# EAGLE design Pico_40Pin_Keyboard (EAGLE 9.6.2)
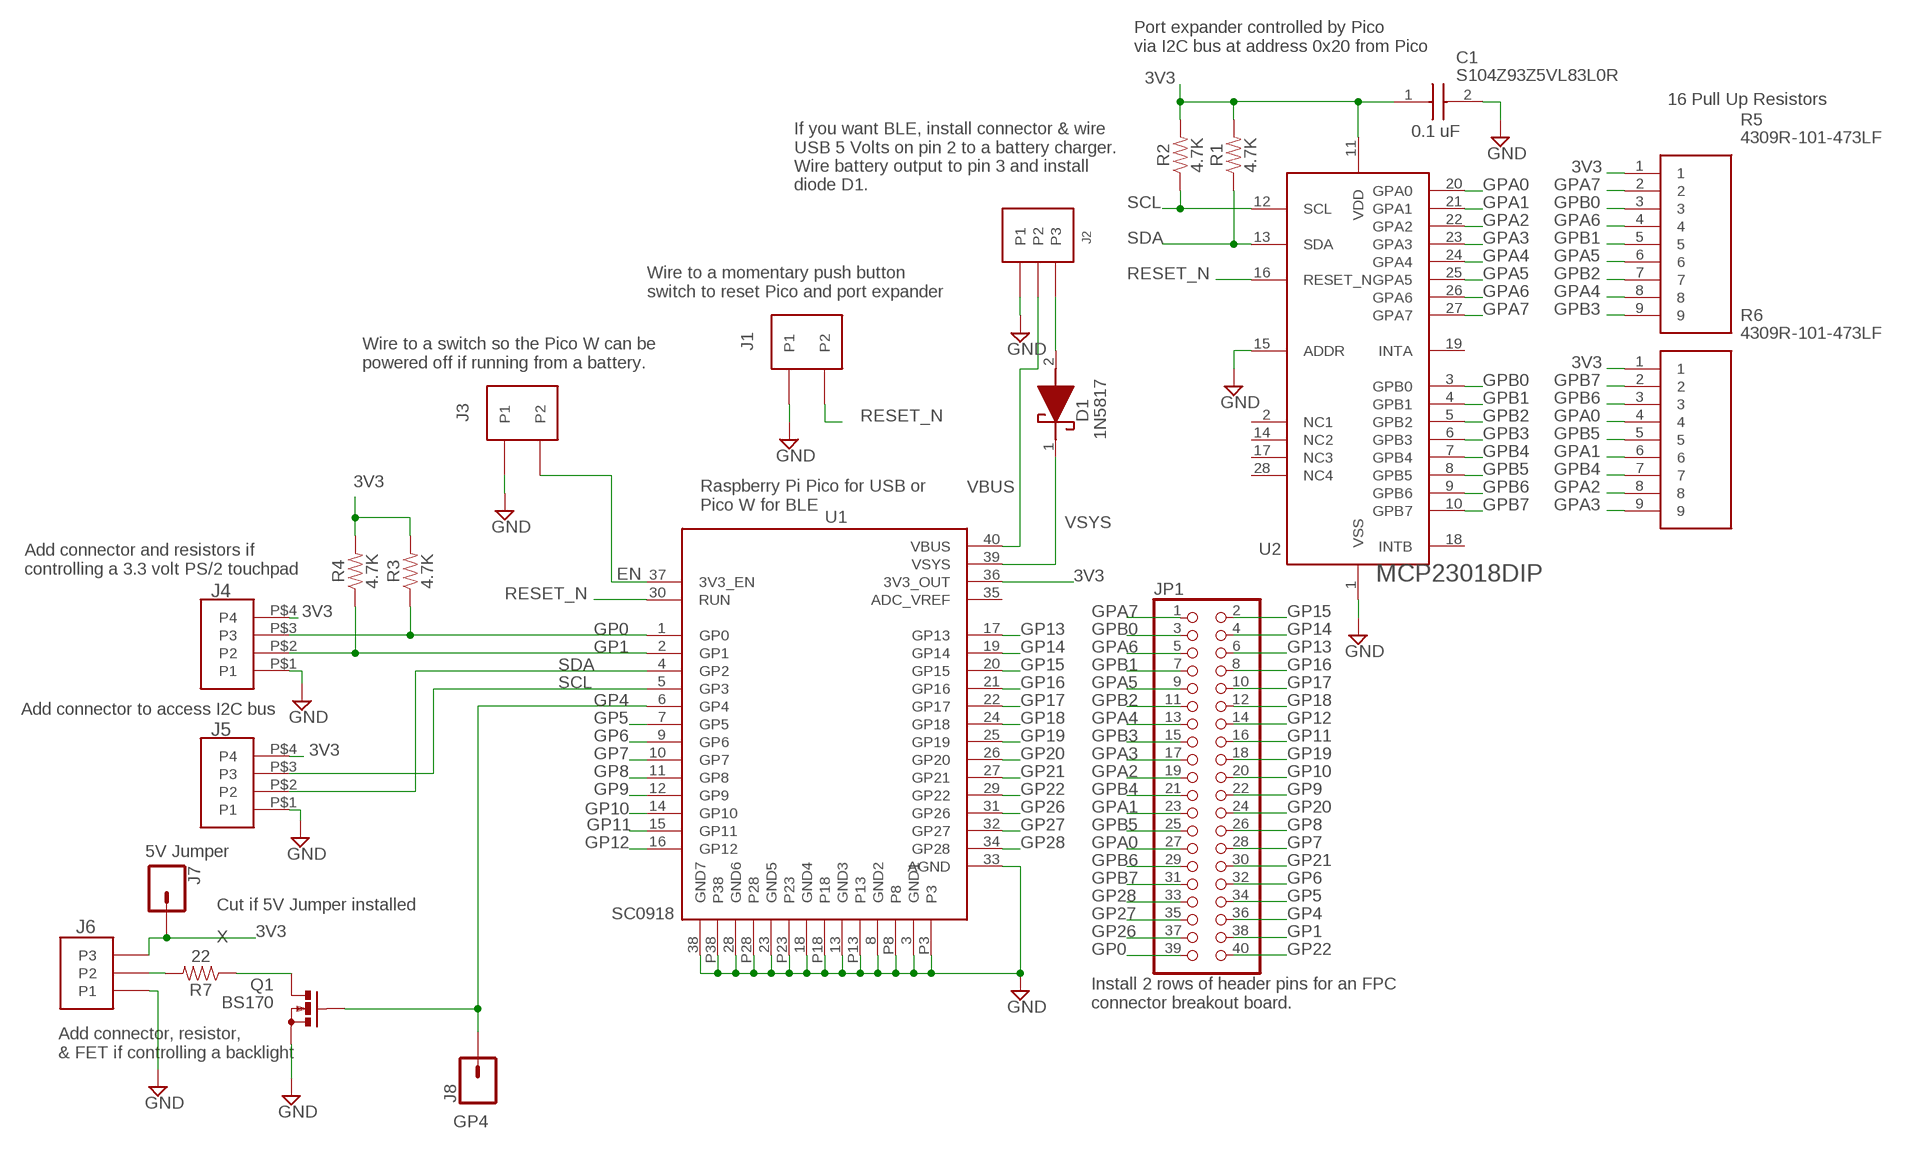
[diagram p0: schematic, sheet 1]

## Parts
C1  S104Z93Z5VL83L0R  [S104Z93Z5VL83L0R]
D1  1N5817  [DIOAD1410W86L470D235]
J1  JST-PH-2PIN  [JST-PH-2PIN]
J2  JST-PH-3PIN  [JST-PH-3PIN]
J3  JST-PH-2PIN  [JST-PH-2PIN]
J4  JST-PH-4PIN  [JST-PH-4PIN]
J5  JST-PH-4PIN  [JST-PH-4PIN]
J6  JST-PH-3PIN  [JST-PH-3PIN]
J7  CONN_01  [1X01]
J8  CONN_01  [1X01]
JP1  PINHD-2X20  [2X20]
Q1  BS170  [SOT54E]
R1  4.7K  RESISTOR_AXIAL  [AXIAL-0.3]
R2  4.7K  RESISTOR_AXIAL  [AXIAL-0.3]
R3  4.7K  RESISTOR_AXIAL  [AXIAL-0.3]
R4  4.7K  RESISTOR_AXIAL  [AXIAL-0.3]
R5  4309R-101-473LF  [4309R-101-473LF]
R6  4309R-101-473LF  [4309R-101-473LF]
R7  22  RESISTOR_AXIAL  [AXIAL-0.3]
U1  SC0918  [MODULE_SC0918]
U2  MCP23018DIP  [MCP23018DIP]

## Nets
3V3: C1.1 J4.P$4(P4) J5.P$4(P4) J6.P$3(P3) J7.1 R1.P$2 R2.P$2 R3.P$2 R4.P$2 R5.1 R6.1 U1.36(3V3_OUT) U2.11(VDD)
EN: J3.P$2(P2) U1.37(3V3_EN)
GND: C1.2 J1.P$1(P1) J2.P$1(P1) J3.P$1(P1) J4.P$1(P1) J5.P$1(P1) J6.P$1(P1) Q1.S U1.3(GND1) U1.8(GND2) U1.13(GND3) U1.18(GND4) U1.23(GND5) U1.28(GND6) U1.33(AGND) U1.38(GND7) U1.P3 U1.P8 U1.P13 U1.P18 U1.P23 U1.P28 U1.P38 U2.1(VSS) U2.15(ADDR)
GP0: J4.P$3(P3) JP1.39 R3.P$1 U1.1(GP0)
GP1: J4.P$2(P2) JP1.38 R4.P$1 U1.2(GP1)
GP4: J8.1 JP1.36 Q1.G U1.6(GP4)
GP5: JP1.34 U1.7(GP5)
GP6: JP1.32 U1.9(GP6)
GP7: JP1.28 U1.10(GP7)
GP8: JP1.26 U1.11(GP8)
GP9: JP1.22 U1.12(GP9)
GP10: JP1.20 U1.14(GP10)
GP11: JP1.16 U1.15(GP11)
GP12: JP1.14 U1.16(GP12)
GP13: JP1.6 U1.17(GP13)
GP14: JP1.4 U1.19(GP14)
GP15: JP1.2 U1.20(GP15)
GP16: JP1.8 U1.21(GP16)
GP17: JP1.10 U1.22(GP17)
GP18: JP1.12 U1.24(GP18)
GP19: JP1.18 U1.25(GP19)
GP20: JP1.24 U1.26(GP20)
GP21: JP1.30 U1.27(GP21)
GP22: JP1.40 U1.29(GP22)
GP26: JP1.37 U1.31(GP26)
GP27: JP1.35 U1.32(GP27)
GP28: JP1.33 U1.34(GP28)
GPA0: JP1.27 R6.4 U2.20(GPA0)
GPA1: JP1.23 R6.6 U2.21(GPA1)
GPA2: JP1.19 R6.8 U2.22(GPA2)
GPA3: JP1.17 R6.9 U2.23(GPA3)
GPA4: JP1.13 R5.8 U2.24(GPA4)
GPA5: JP1.9 R5.6 U2.25(GPA5)
GPA6: JP1.5 R5.4 U2.26(GPA6)
GPA7: JP1.1 R5.2 U2.27(GPA7)
GPB0: JP1.3 R5.3 U2.3(GPB0)
GPB1: JP1.7 R5.5 U2.4(GPB1)
GPB2: JP1.11 R5.7 U2.5(GPB2)
GPB3: JP1.15 R5.9 U2.6(GPB3)
GPB4: JP1.21 R6.7 U2.7(GPB4)
GPB5: JP1.25 R6.5 U2.8(GPB5)
GPB6: JP1.29 R6.3 U2.9(GPB6)
GPB7: JP1.31 R6.2 U2.10(GPB7)
N$1: J6.P$2(P2) R7.P$2
N$2: Q1.D R7.P$1
RESET_N: J1.P$2(P2) U1.30(RUN) U2.16(RESET_N)
SCL: J5.P$3(P3) R2.P$1 U1.5(GP3) U2.12(SCL)
SDA: J5.P$2(P2) R1.P$1 U1.4(GP2) U2.13(SDA)
VBAT: D1.2(A) J2.P$3(P3)
VBUS: J2.P$2(P2) U1.40(VBUS)
VSYS: D1.1(K) U1.39(VSYS)
Unconnected: U2.2(NC1) U2.14(NC2) U2.17(NC3) U2.18(INTB) U2.19(INTA) U2.28(NC4)

## Notes on the sheet
- Port expander controlled by Pico
  via I2C bus at address 0x20 from Pico
- 16 Pull Up Resistors
- 0.1 uF
- If you want BLE, install connector & wire
   USB 5 Volts on pin 2 to a battery charger.
   Wire battery output to pin 3 and install
   diode D1.
- Wire to a momentary push button 
  switch to reset Pico and port expander
- Wire to a switch so the Pico W can be
  powered off if running from a battery.
- Raspberry Pi Pico for USB or 
  Pico W for BLE
- Add connector and resistors if
  controlling a 3.3 volt PS/2 touchpad
- Add connector to access I2C bus
- 5V Jumper
- Cut if 5V Jumper installed
- X
- Install 2 rows of header pins for an FPC
  connector breakout board.
- Add connector, resistor, 
  & FET if controlling a backlight
- GP4

## Power pins joined to a net without a drawn wire
ADC_VREF: U1.35(ADC_VREF)

## Library data of the parts
C1 = SamacSys_Parts:S104Z93Z5VL83L0R: 0.1 F -20%, +80% 500V Ceramic Capacitor Z5V Radial, Disc Source: Datasheet <http://www.vishay.com/docs/28546/s104z93z.pdf>; DESCRIPTION: 0.1 F -20%, +80% 500V Ceramic Capacitor Z5V Radial, Disc; HEIGHT: 26.6mm; MANUFACTURER_NAME: Vishay; MANUFACTURER_PART_NUMBER: S104Z93Z5VL83L0R; MOUSER_PART_NUMBER: 594-S104Z93Z5VL83L0R; MOUSER_PRICE-STOCK: https://www.mouser.co.uk/ProductDetail/Vishay-BC-Components/S104Z93Z5VL83L0R?qs=MZE%2F3ll%252Bp%2Fba6C%252BzoK7Jpg%3D%3D
D1 = SamacSys_Parts:1N5817: Schottky Diodes & Rectifiers 1A, 20V, Schottky Rectifier Source: Datasheet <https://services.taiwansemi.com/storage/resources/datasheet/1N5817 SERIES_H2104.pdf>; DESCRIPTION: Schottky Diodes & Rectifiers 1A, 20V, Schottky Rectifier; HEIGHT: mm; MANUFACTURER_NAME: Taiwan Semiconductor; MANUFACTURER_PART_NUMBER: 1N5817; MOUSER_PART_NUMBER: 821-1N5817; MOUSER_PRICE-STOCK: https://www.mouser.co.uk/ProductDetail/Taiwan-Semiconductor/1N5817?qs=G5AQjGfRJcITga2hz4Rc2w%3D%3D
J1 J3 = JST-PH-2PIN:JST-PH-2PIN
J2 J6 = JST-PH-3PIN:JST-PH-3PIN
J4 J5 = JST-PH-4PIN:JST-PH-4PIN
J7 J8 = SparkFun-Connectors:CONN_01: Single connection point. Often used as Generic Header-pin footprint for 0.1 inch spaced/style header connections On any of the 0.1 inch spaced packages, you can populate with these: Break Away Headers - Straight <https://www.sparkfun.com/products/116> (PRT-00116) Break Away Male Headers - Right Angle <https://www.sparkfun.com/products/553> (PRT-00553) Female Headers <https://www.sparkfun.com/products/115> (PRT-00115) Break Away Headers - Machine Pin <https://www.sparkfun.com/products/117> (PRT-00117) Break Away Female Headers - Swiss Machine Pin <https://www.sparkfun.com/products/743> (PRT-00743) This device is also useful as a general connection point to wire up your design to another part of your project. Our various solder wires solder well into these plated through hole pads. Hook-Up Wire - Assortment (Stranded, 22 AWG) <https://www.sparkfun.com/products/11375> (PRT-11375) Hook-Up Wire - Assortment (Solid Core, 22 AWG) <https://www.sparkfun.com/products/11367> (PRT-11367) View the entire wire category on our website here <https://www.sparkfun.com/categories/141> Special notes: SMTSO-256-ET is a "flush mount" nut for a 4-40 screw. We mostly use this on specialty testbeds; it is a nice way to connect hardware to your PCB at an adjustable hieght. Also note, the SNAP packages are for using a snappable style connector. We sell a baggie of snaps and they are also used on two LilyPad designs: Snap Assortment - 30 pack (male and female) <https://www.sparkfun.com/products/11347> (DEV-11347) LilyPad Arduino SimpleSnap <https://www.sparkfun.com/products/10941> (DEV-10941) LilyPad SimpleSnap Protoboard <https://www.sparkfun.com/products/10940> (DEV-10940)
JP1 = pinhead:PINHD-2X20: PIN HEADER
Q1 = transistor-small-signal:BS170: N-CHANNEL MOS FET
R1-R4 R7 = Resistor_Axial:RESISTOR_AXIAL
R5 R6 = SamacSys_Parts:4309R-101-473LF
U1 = SC0918:SC0918: Check availability <https://pricing.snapeda.com/parts/SC0918/Raspberry%20Pi/view-part?ref=eda>; AVAILABILITY: In Stock; CHECK_PRICES: https://www.snapeda.com/parts/SC0918/Raspberry+Pi/view-part/?ref=eda; DESCRIPTION: - RP2040 Transceiver; 802.11 b/g/n (Wi-Fi, WiFi, WLAN), Bluetooth® 5.x 2.4GHz Evaluation Board; MF: Raspberry Pi; MP: SC0918; PACKAGE: None; PRICE: None; SNAPEDA_LINK: https://www.snapeda.com/parts/SC0918/Raspberry+Pi/view-part/?ref=snap
U2 = MCP23018DIP:MCP23018DIP

## Board
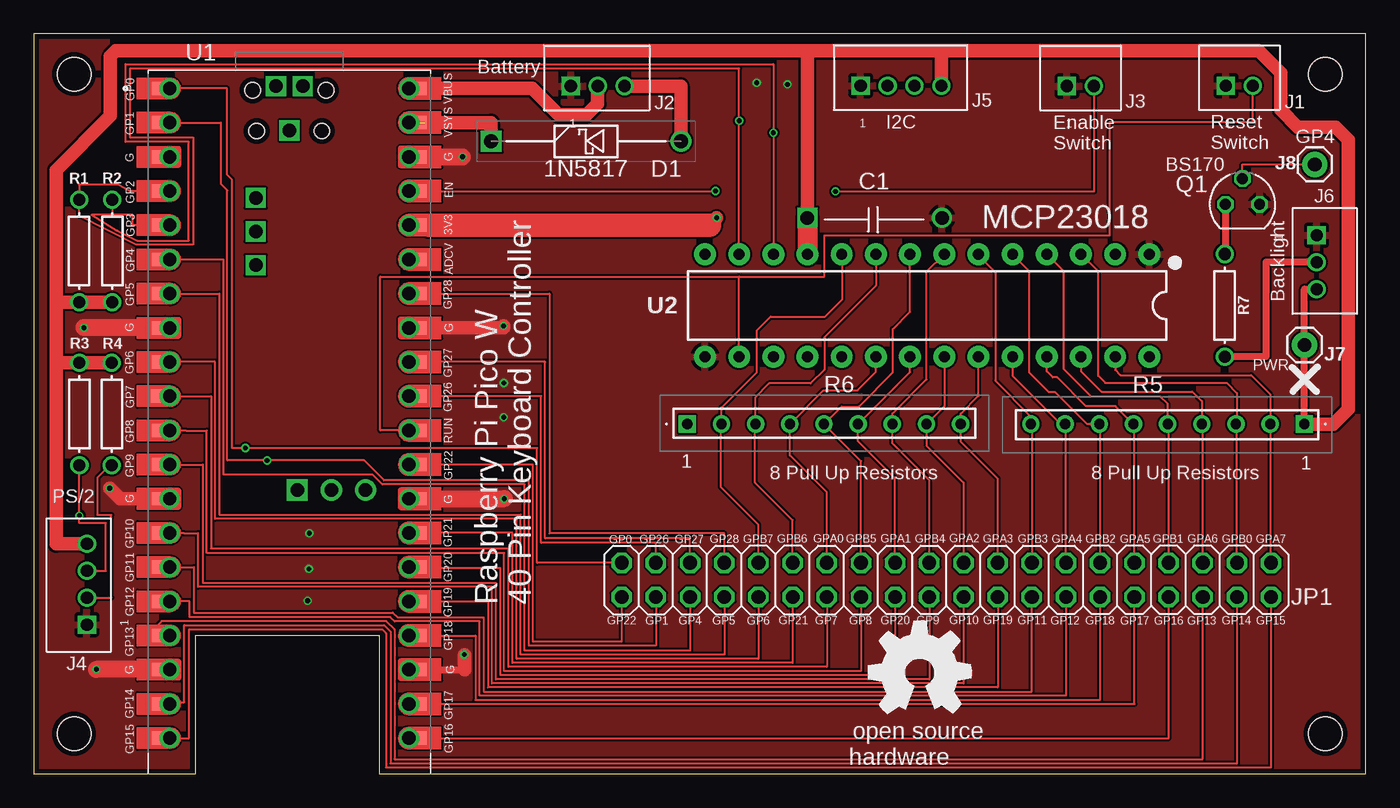
[diagram p1: board, top side]
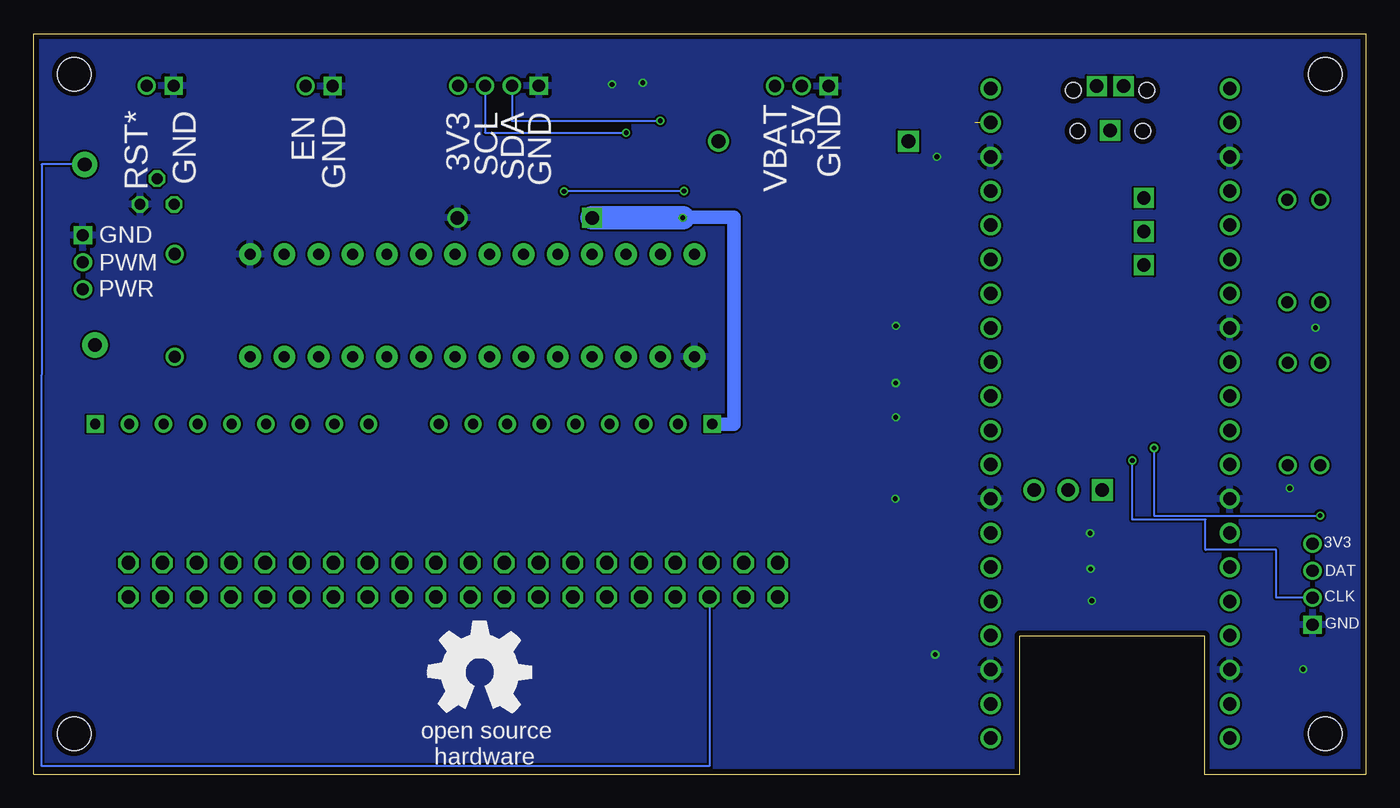
[diagram p2: board, bottom side, seen from below]

Size 99 x 55.02 mm. Coordinates in mm from the lower left corner, seen from the top.
Outline: 99,0.02 99,55.02 0,55.02 0,0.02 12,0.02 12,10.3 25.72,10.28 25.72,0 99,0.02
Copper layers (1*16): Top 0.035559375mm / dielectric 1.6mm / Bottom 0.035559375mm
Design rules "oshpark-2layer": minimum track width 6mil, minimum drill 10mil, track to track 6mil, track to pad 6mil, pad to pad 6mil, via to via 6mil, smd to smd 6mil, copper to edge 15mil, drill to drill 6mil, minimum pad ring 5mil, minimum via ring 5mil, stop-mask expansion 2.5mil, vias tented up to drill 0mil, thermal gap 10mil
Holes 2.5 mm at 96,52.02 96,3.02 3,3.02 3,52.02

### Footprints (pad centres in the part's own frame; a part is rotated, then mirrored left to right if it is on the bottom)
S104Z93Z5VL83L0R = drill 1 pad 1.5 square: 1 0,0 | drill 1 pad 1.5: 2 10,0
DIOAD1410W86L470D235 = drill 1.05 pad 1.575 square: 1 0,0 | drill 1.05 pad 1.575: 2 14.1,0
JST-PH-2PIN = drill 0.9 square: P$1 -1,0 | drill 0.9: P$2 1,0
JST-PH-3PIN = drill 0.9 square: P$1 -2.98,0.01 | drill 0.9: P$2 -0.98,0.01; P$3 1.02,0.01
JST-PH-4PIN = drill 0.9 square: P$1 -2.98,0.01 | drill 0.9: P$2 -0.98,0.01; P$3 1.02,0.01; P$4 3.02,0.01
1X01 = drill 1.016 pad 1.88: 1 0,0
2X20 = drill 1.016 octagon: 1 -24.13,-1.27; 2 -24.13,1.27; 3 -21.59,-1.27; 4 -21.59,1.27; 5 -19.05,-1.27; 6 -19.05,1.27; 7 -16.51,-1.27; 8 -16.51,1.27; 9 -13.97,-1.27; 10 -13.97,1.27; 11 -11.43,-1.27; 12 -11.43,1.27; 13 -8.89,-1.27; 14 -8.89,1.27; 15 -6.35,-1.27; 16 -6.35,1.27; 17 -3.81,-1.27; 18 -3.81,1.27; 19 -1.27,-1.27; 20 -1.27,1.27; 21 1.27,-1.27; 22 1.27,1.27; 23 3.81,-1.27; 24 3.81,1.27; 25 6.35,-1.27; 26 6.35,1.27; 27 8.89,-1.27; 28 8.89,1.27; 29 11.43,-1.27; 30 11.43,1.27; 31 13.97,-1.27; 32 13.97,1.27; 33 16.51,-1.27; 34 16.51,1.27; 35 19.05,-1.27; 36 19.05,1.27; 37 21.59,-1.27; 38 21.59,1.27; 39 24.13,-1.27; 40 24.13,1.27
SOT54E = drill 0.813 octagon: D -1.27,0; G 0,1.905; S 1.27,0
AXIAL-0.3 = drill 0.9: P$1 -3.81,0; P$2 3.81,0
4309R-101-473LF = drill 0.75 pad 1.286 square: 1 -11.43,0 | drill 0.75 pad 1.286: 2 -8.89,0; 3 -6.35,0; 4 -3.81,0; 5 -1.27,0; 6 1.27,0; 7 3.81,0; 8 6.35,0; 9 8.89,0
MODULE_SC0918 = smd 1 x 1: 1 -9.69,24.13; 2 -9.69,21.59; 3 -9.69,19.05; 4 -9.69,16.51; 5 -9.69,13.97; 6 -9.69,11.43; 7 -9.69,8.89; 8 -9.69,6.35; 9 -9.69,3.81; 10 -9.79,1.27; 11 -9.69,-1.27; 12 -9.69,-3.81; 13 -9.69,-6.35; 14 -9.69,-8.89; 15 -9.69,-11.43; 16 -9.69,-13.97; 17 -9.69,-16.51; 18 -9.69,-19.05; 19 -9.69,-21.59; 20 -9.69,-24.13; 21 9.69,-24.13; 22 9.69,-21.59; 23 9.69,-19.05; 24 9.69,-16.51; 25 9.69,-13.97; 26 9.69,-11.43; 27 9.69,-8.89; 28 9.69,-6.35; 29 9.69,-3.81; 30 9.69,-1.27; 31 9.69,1.27; 32 9.69,3.81; 33 9.69,6.35; 34 9.69,8.89; 35 9.69,11.43; 36 9.69,13.97; 37 9.69,16.51; 38 9.69,19.05; 39 9.69,21.59; 40 9.69,24.13 | drill 1 pad 1.575 square: E 0.584,-5.7 | drill 1 pad 1.575: F 3.124,-5.7; G 5.664,-5.7 | drill 1: P1 -8.89,24.13; P2 -8.89,21.59; P3 -8.89,19.05; P4 -8.89,16.51; P5 -8.89,13.97; P6 -8.89,11.43; P7 -8.89,8.89; P8 -8.89,6.35; P9 -8.89,3.81; P10 -8.89,1.27; P11 -8.89,-1.27; P12 -8.89,-3.81; P13 -8.89,-6.35; P14 -8.89,-8.89; P15 -8.89,-11.43; P16 -8.89,-13.97; P17 -8.89,-16.51; P18 -8.89,-19.05; P19 -8.89,-21.59; P20 -8.89,-24.13; P21 8.89,-24.13; P22 8.89,-21.59; P23 8.89,-19.05; P24 8.89,-16.51; P25 8.89,-13.97; P26 8.89,-11.43; P27 8.89,-8.89; P28 8.89,-6.35; P29 8.89,-3.81; P30 8.89,-1.27; P31 8.89,1.27; P32 8.89,3.81; P33 8.89,6.35; P34 8.89,8.89; P35 8.89,11.43; P36 8.89,13.97; P37 8.89,16.51; P38 8.89,19.05; P39 8.89,21.59; P40 8.89,24.13 | drill 1 pad 1.5 square: TP1 0,21; TP2 1,24.3; TP3 -1,24.3; TP4 -2.5,16; TP5 -2.5,13.5; TP6 -2.5,11 | hole 1.15: -2.425,20.97; 2.425,20.97; -2.725,24; 2.725,24
MCP23018DIP = drill 0.813 pad 1.626: 1 0,0; 2 2.54,0; 3 5.08,0; 4 7.62,0; 5 10.16,0; 6 12.7,0; 7 15.24,0; 8 17.78,0; 9 20.32,0; 10 22.86,0; 11 25.4,0; 12 27.94,0; 13 30.48,0; 14 33.02,0; 15 33.02,7.62; 16 30.48,7.62; 17 27.94,7.62; 18 25.4,7.62; 19 22.86,7.62; 20 20.32,7.62; 21 17.78,7.62; 22 15.24,7.62; 23 12.7,7.62; 24 10.16,7.62; 25 7.62,7.62; 26 5.08,7.62; 27 2.54,7.62; 28 0,7.62

### Placement (x,y rotation side)
C1  57.5,41.34 0 top
D1  34,47.02 0 top
J1  89.6,51.15 0 top
J2  42.9,51.12 0 top
J3  77.79,51.13 0 top
J4  3.97,14.1 90 top
J5  64.44,51.15 0 top
J6  95.33,37.06 270 top
J7  94.44,31.89 0 top
J8  95.21,45.31 0 top
JP1  67.83,14.44 180 top
Q1  89.83,42.34 0 top
R1  3.38,38.88 270 top
R2  5.84,38.88 270 top
R3  3.4,26.77 90 top
R4  5.81,26.77 90 top
R5  83,26.02 180 top
R6  60,26.02 0 top
R7  88.51,34.84 270 top
U1  19,26.82 0 top
U2  82.91,38.64 180 top
U$1  [OSHW_8MM]  65.82,7.55 0 top
U$2  [OSHW_8MM]  65.82,7.57 0 top

### Tracks (layer width: path | path; a pad name or v marks a point on that pad's centre or on a via)
3V3  (via drill 0.35)
  Top 0.152: U1.36 29.36,40.79
  Top 0.508: R5.1 J7.1 | J6.P$3 94.44,36.04 J7.1
  Top 1.016: U2.11 | v50.76,41.34 50.21,40.79 | R2.P$2 R1.P$2 1.67,35.07 | 1.67,35.07 1.67,44.89 5.69,48.91 5.69,53.34 6.1,53.75 57.5,53.75 | J4.P$4 1.67,17.12 1.67,30.58 | 1.67,30.58 1.67,35.07 | 1.67,30.58 R3.P$2 R4.P$2 | 57.5,53.75 67.46,53.75 | J5.P$4 67.46,53.75 | C1.1 57.5,53.75 | 67.46,53.75 91.04,53.75 92.66,52.13 92.66,49.35 93.93,48.08 96.76,48.08 97.69,47.15 97.69,27.13 96.58,26.02 R5.1 | J7.1
  Top 1.5: C1.1 U2.11
  Top 1.75: 29.36,40.79 50.21,40.79
  Bottom 1.016: R6.1 46.96,26.02 46.96,41.39 50.76,41.39 v50.76,41.34
  Bottom 1.75: C1.1 v50.76,41.34
EN  (via drill 0.35)
  Top 0.152: U1.37 v50.67,43.33 | v59.59,43.3 78.79,43.3 J3.P$2
  Bottom 0.152: v50.67,43.33 59.61,43.33 59.61,43.3 v59.59,43.3
GND  (via drill 0.35)
  Top 0.152: U1.P28 U1.28 30.29,20.47
  Top 0.508: U1.23 32.01,7.77
  Top 1.016: U1.13 6.43,20.47 v5.65,21.25 | U1.33 34.92,33.17 v34.92,33.31 | 32.01,7.77 v32.01,8.9
  Top 1.27: U1.P23 U1.23 | U1.P18 U1.18 9.28,7.8 v4.66,7.8 | U1.P8 U1.8 v3.74,33.18 | U1.P13 U1.13 | U1.P38 U1.38 v31.87,45.87 | U1.28 v34.97,20.47
  other vias: 53.73,51.38 56.02,51.25 34.93,26.53 34.94,29.07 20.49,17.91 20.45,15.26 20.36,12.9
  pour Top: 0,-0.08 0,54.92 99,54.92 99,-0.08 25.72,-0.08 25.72,10.22 12,10.22 12,-0.08
  pour Bottom: -0.1,-0.08 -0.1,54.92 99.1,54.92 99.1,-0.08 25.72,-0.08 25.72,10.22 12,10.22 12,-0.08
GP0  (via drill 0.35)
  Top 0.152: JP1.39 37.41,15.71 37.41,24.24 v15.74,24.24 14.75,24.24 14.75,44.17 14.38,44.54 14.38,50.95 U1.1 | J4.P$3 5.37,15.12 5.37,18.66 3.4,18.66 v3.4,19.22 R3.P$1
  Bottom 0.152: v15.74,24.24 15.74,19.22 v3.4,19.22
GP1  (via drill 0.35)
  Top 0.152: JP1.38 46.24,9.56 36.8,9.56 36.8,21.84 26.04,21.84 24.56,23.32 v17.36,23.32 14.4,23.32 14.4,43.37 13.92,43.85 13.92,48.41 U1.2 | J4.P$2 5.77,13.12 5.77,19.25 4.75,19.25 4.75,22.05 5.66,22.96 R4.P$1
  Bottom 0.152: J4.P$2 6.67,13.12 6.67,16.68 11.93,16.68 11.93,18.91 17.36,18.91 v17.36,23.32
GP4
  Top 0.152: JP1.36 48.78,9.19 36.5,9.19 36.5,21.53 25.91,21.53 25.18,22.26 14.09,22.26 14.09,38.25 U1.6 | Q1.G 89.83,45.31 J8.1
  Bottom 0.152: JP1.36 48.78,0.6 98.41,0.6 98.41,29.6 98.41,29.68 98.41,45.31 J8.1
GP5
  Top 0.152: JP1.34 51.32,8.89 36.19,8.89 36.19,19.3 13.79,19.3 13.79,35.71 U1.7
GP6
  Top 0.152: JP1.32 53.86,8.58 35.89,8.58 35.89,18.98 13.48,18.98 13.48,30.63 U1.9
GP7
  Top 0.152: JP1.28 58.94,7.97 35.28,7.97 35.28,16.77 13.18,16.77 13.18,28.09 U1.10
GP8
  Top 0.152: JP1.26 61.48,7.67 34.97,7.67 34.97,16.44 12.88,16.44 12.88,25.54 11.33,25.54 11.33,25.55 U1.11
GP9
  Top 0.152: JP1.22 66.56,7.06 34.36,7.06 34.36,14.23 12.57,14.23 12.57,23.01 U1.12
GP10
  Top 0.152: JP1.20 69.1,6.75 34.06,6.75 34.06,13.92 12.22,13.92 12.22,17.92 11.15,17.92 11.15,17.93 U1.14
GP11
  Top 0.152: U1.15 11.9,15.39 11.9,12.02 26.69,12.02 27.05,11.66 33.45,11.66 33.45,6.14 74.18,6.14 JP1.16
GP12
  Top 0.152: JP1.14 76.72,5.84 33.15,5.84 33.15,11.35 26.84,11.35 26.5,11.68 11.59,11.68 11.59,12.85 U1.16
GP13
  Top 0.152: JP1.6 86.88,1.12 26.82,1.12 26.82,10.77 26.81,10.77 26.2,11.38 9.5,11.38 9.09,10.97 9.09,10.53 U1.17
GP14
  Top 0.152: JP1.4 89.42,0.82 26.52,0.82 26.52,10.6 26.04,11.07 11.21,11.07 11.21,5.36 9.31,5.36 U1.19
GP15
  Top 0.152: JP1.2 91.96,0.51 26.19,0.51 26.19,10.48 25.9,10.77 11.54,10.77 11.54,2.69 U1.20
GP16
  Top 0.152: U1.21 84.34,2.69 JP1.8
GP17
  Top 0.152: U1.22 81.8,5.23 JP1.10
GP18
  Top 0.152: U1.24 32.84,10.31 32.84,5.53 79.26,5.53 JP1.12
GP19
  Top 0.152: JP1.18 71.64,6.45 33.75,6.45 33.75,12.85 U1.25
GP20
  Top 0.152: JP1.24 64.02,7.36 34.67,7.36 34.67,15.34 28.69,15.34 U1.26
GP21
  Top 0.152: JP1.30 56.4,8.28 35.58,8.28 35.58,17.93 U1.27
GP22
  Top 0.152: JP1.40 43.7,9.87 37.11,9.87 37.11,23.01 U1.29
GP26
  Top 0.152: JP1.37 46.24,17.19 37.72,17.19 37.72,28.09 U1.31
GP27
  Top 0.152: JP1.35 48.78,17.53 38.02,17.53 38.02,30.63 U1.32
GP28
  Top 0.152: JP1.33 51.32,17.89 38.33,17.89 38.33,35.71 U1.34
GPA0
  Top 0.152: JP1.27 58.94,20.95 56.19,23.7 R6.4 58.7,28.53 61.23,28.53 62.59,29.89 U2.20
GPA1
  Top 0.152: JP1.23 64.02,21.99 61.27,24.74 R6.6 65.13,29.88 U2.21
GPA2
  Top 0.152: U2.22 67.67,27.34 R6.8 66.35,24.42 69.1,21.67 JP1.19
GPA3
  Top 0.152: JP1.17 71.64,21.96 68.89,24.71 R6.9 68.89,26.79 70.21,28.11 U2.23
GPA4
  Top 0.152: JP1.13 76.72,25.95 R5.8 76.35,26.02 72.75,29.62 U2.24
GPA5
  Top 0.152: JP1.9 81.8,25.95 R5.6 80.39,27.36 78.19,27.36 76.06,29.49 75.74,29.49 75.29,29.94 U2.25
GPA6
  Top 0.152: JP1.5 86.88,25.95 R5.4 86.81,27.72 86.1,28.43 79.35,28.43 77.83,29.95 U2.26
GPA7
  Top 0.152: U2.27 80.37,30.04 80.76,29.65 90.47,29.65 91.89,28.23 R5.2 91.89,15.78 JP1.1
GPB0
  Top 0.152: JP1.3 89.42,25.95 | 89.42,25.95 R5.3 | 89.42,25.95 89.42,28.31 88.66,29.07 79.64,29.07 79.11,29.6 79.11,37.36 U2.3
GPB1
  Top 0.152: JP1.7 84.34,25.95 R5.5 84.27,27.52 83.73,28.06 78.6,28.06 76.56,30.1 76.56,37.37 U2.4
GPB2
  Top 0.152: JP1.11 79.26,25.95 R5.7 78.29,26.02 75.92,28.39 75.45,28.39 74.01,29.83 74.01,37.38 U2.5
GPB3
  Top 0.152: JP1.15 74.18,25.95 R5.9 74.11,26.58 71.47,29.22 71.47,29.29 71.47,37.28 70.21,38.54 U2.6
GPB4
  Top 0.152: JP1.21 66.56,21.85 63.81,24.6 R6.7 63.81,26.8 66.35,29.34 66.35,37.32 U2.7
GPB5
  Top 0.152: JP1.25 61.48,23.27 R6.5 60.03,27.32 61.32,27.32 63.85,29.85 63.85,33.07 65.13,34.35 U2.8
GPB6
  Top 0.152: 53.61,25.98 53.61,21.67 56.4,18.88 JP1.29 | 53.61,25.98 R6.3 | U2.9 62.59,36.3 58.75,32.46 58.75,30.06 57.73,29.04 54.66,29.04 53.61,27.99 53.61,25.98
GPB7
  Top 0.152: U2.10 60.05,35.25 58.8,34.01 54.77,34.01 53.74,32.98 53.74,29.87 51.11,27.24 R6.2 51.06,25.97 51.06,21.34 53.86,18.54 JP1.31
N$1
  Top 0.508: J6.P$2 91.57,38.04 91.57,31.03 R7.P$2
N$2
  Top 0.508: Q1.D 88.56,38.65 R7.P$1
RESET_N
  Top 0.152: U1.30 25.76,25.55 25.76,36.97 52.43,36.97 | U2.16 52.43,36.97 | 52.43,36.97 58.75,36.97 58.75,40.04 79.97,40.04 79.97,48.46 90.6,48.46 J1.P$2
SCL  (via drill 0.35)
  Top 0.152: U1.5 9.29,40.77 7.36,40.77 7.36,41.56 5.84,41.56 | R2.P$1 5.84,41.56 | U2.12 v54.97,47.66 54.97,52.76 6.84,52.76 6.84,46.99 11.54,46.99 11.54,39.65 7.69,39.65 6.22,40.39 4.3,41.56 5.84,41.56
  Bottom 0.152: J5.P$3 65.46,47.66 v54.97,47.66
SDA  (via drill 0.35)
  Top 0.152: U1.4 9.29,43.31 7.16,43.31 6.27,43.8 3.38,43.8 R1.P$1 3.38,41.49 7.62,39.34 11.84,39.34 11.84,47.32 7.15,47.32 7.15,52.42 52.43,52.42 v52.43,48.55 U2.13
  Bottom 0.152: J5.P$2 63.46,48.54 v52.42,48.54 v52.42,48.55 v52.43,48.55
VBAT
  Top 1.016: J2.P$3 48.1,51.13 D1.2
VBUS
  Top 1.016: J2.P$2 41.92,49.8 41.1,48.98 38.99,48.98 37.02,50.95 U1.40
VSYS  (1 unrouted)
  Top 0.508: 29.08,48.44 29.05,48.41
  Top 1.016: U1.39 34,48.41 D1.1

### Text on the board
tPlace: Battery | GP0 | VBUS | I2C | GP1 | VSYS | GP4 | G | Enable / Switch | Reset / Switch | G | BS170 | 1N5817 | EN | GP2 | MCP23018 | GP3 | 3V3 | GP4 | ADCV | GP5 | GP28 | Backlight | G | G | GP6 | PWR | GP27 | GP7 | GP26 | GP8 | RUN | 1 | 1 | GP9 | GP22 | 8 Pull Up Resistors | 8 Pull Up Resistors | PS/2 | G | G | GP10 | GP21 | GP0 | GP26 | GP27 | GP28 | GPB7 | GPB6 | GPA0 | GPB5 | GPA1 | GPB4 | GPA2 | GPA3 | GPB3 | GPA4 | GPB2 | GPA5 | GPB1 | GPA6 | GPB0 | GPA7 | GP11 | GP20 | Raspberry Pi Pico W / 40 Pin Keyboard Controller | GP12 | GP19 | GP22 | GP1 | GP4 | GP5 | GP6 | GP21 | GP7 | GP8 | GP20 | GP9 | GP10 | GP19 | GP11 | GP12 | GP18 | GP17 | GP16 | GP13 | GP14 | GP15 | GP13 | GP18 | G | G | GP14 | GP17 | GP15 | GP16
bPlace: GND | 5V | VBAT | GND | SDA | SCL | 3V3 | GND | EN | GND | RST* | GND | PWM | PWR | 3V3 | DAT | CLK | GND